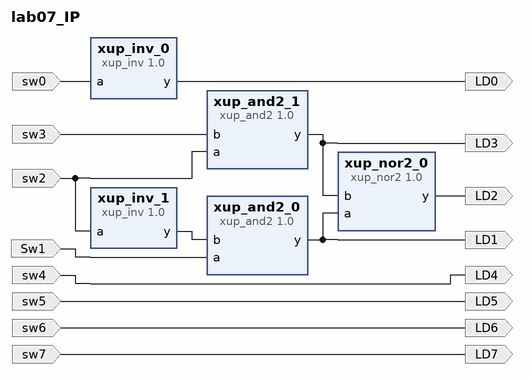
[diagram p0: block diagram of the top level]
# Vivado block design lab07_IP, Vivado 2016.2
create_bd_design lab07_IP

create_bd_port -dir I sw0
create_bd_port -dir O LD0
create_bd_port -dir I Sw1
create_bd_port -dir I sw2
create_bd_port -dir O LD1
create_bd_port -dir I sw3
create_bd_port -dir O LD3
create_bd_port -dir O LD2
create_bd_port -dir O LD4
create_bd_port -dir O LD5
create_bd_port -dir O LD6
create_bd_port -dir O LD7
create_bd_port -dir I sw4
create_bd_port -dir I sw5
create_bd_port -dir I sw6
create_bd_port -dir I sw7

create_bd_cell -type ip -vlnv xilinx.com:xup:xup_inv:1.0 xup_inv_0
create_bd_cell -type ip -vlnv xilinx.com:xup:xup_inv:1.0 xup_inv_1
create_bd_cell -type ip -vlnv xilinx.com:xup:xup_and2:1.0 xup_and2_0
create_bd_cell -type ip -vlnv xilinx.com:xup:xup_and2:1.0 xup_and2_1
create_bd_cell -type ip -vlnv xilinx.com:xup:xup_nor2:1.0 xup_nor2_0

# ---- connections ----

connect_bd_net -net sw0_1 [get_bd_ports sw0] [get_bd_pins xup_inv_0/a]
connect_bd_net [get_bd_pins xup_inv_0/y] [get_bd_ports LD0]
connect_bd_net -net Sw1_1 [get_bd_ports Sw1] [get_bd_pins xup_and2_0/a]
connect_bd_net -net sw2_1 [get_bd_ports sw2] [get_bd_pins xup_inv_1/a] [get_bd_pins xup_and2_1/a]
connect_bd_net [get_bd_pins xup_inv_1/y] [get_bd_pins xup_and2_0/b]
connect_bd_net [get_bd_pins xup_and2_0/y] [get_bd_ports LD1] [get_bd_pins xup_nor2_0/a]
connect_bd_net -net sw3_1 [get_bd_ports sw3] [get_bd_pins xup_and2_1/b]
connect_bd_net [get_bd_pins xup_and2_1/y] [get_bd_ports LD3] [get_bd_pins xup_nor2_0/b]
connect_bd_net [get_bd_pins xup_nor2_0/y] [get_bd_ports LD2]
connect_bd_net -net sw4_1 [get_bd_ports sw4] [get_bd_ports LD4]
connect_bd_net -net sw5_1 [get_bd_ports sw5] [get_bd_ports LD5]
connect_bd_net -net sw6_1 [get_bd_ports sw6] [get_bd_ports LD6]
connect_bd_net -net sw7_1 [get_bd_ports sw7] [get_bd_ports LD7]

validate_bd_design
save_bd_design
